# Altium schematic sheet CH32L103G8R6-R0.SchDoc
size 304 x 254 mm
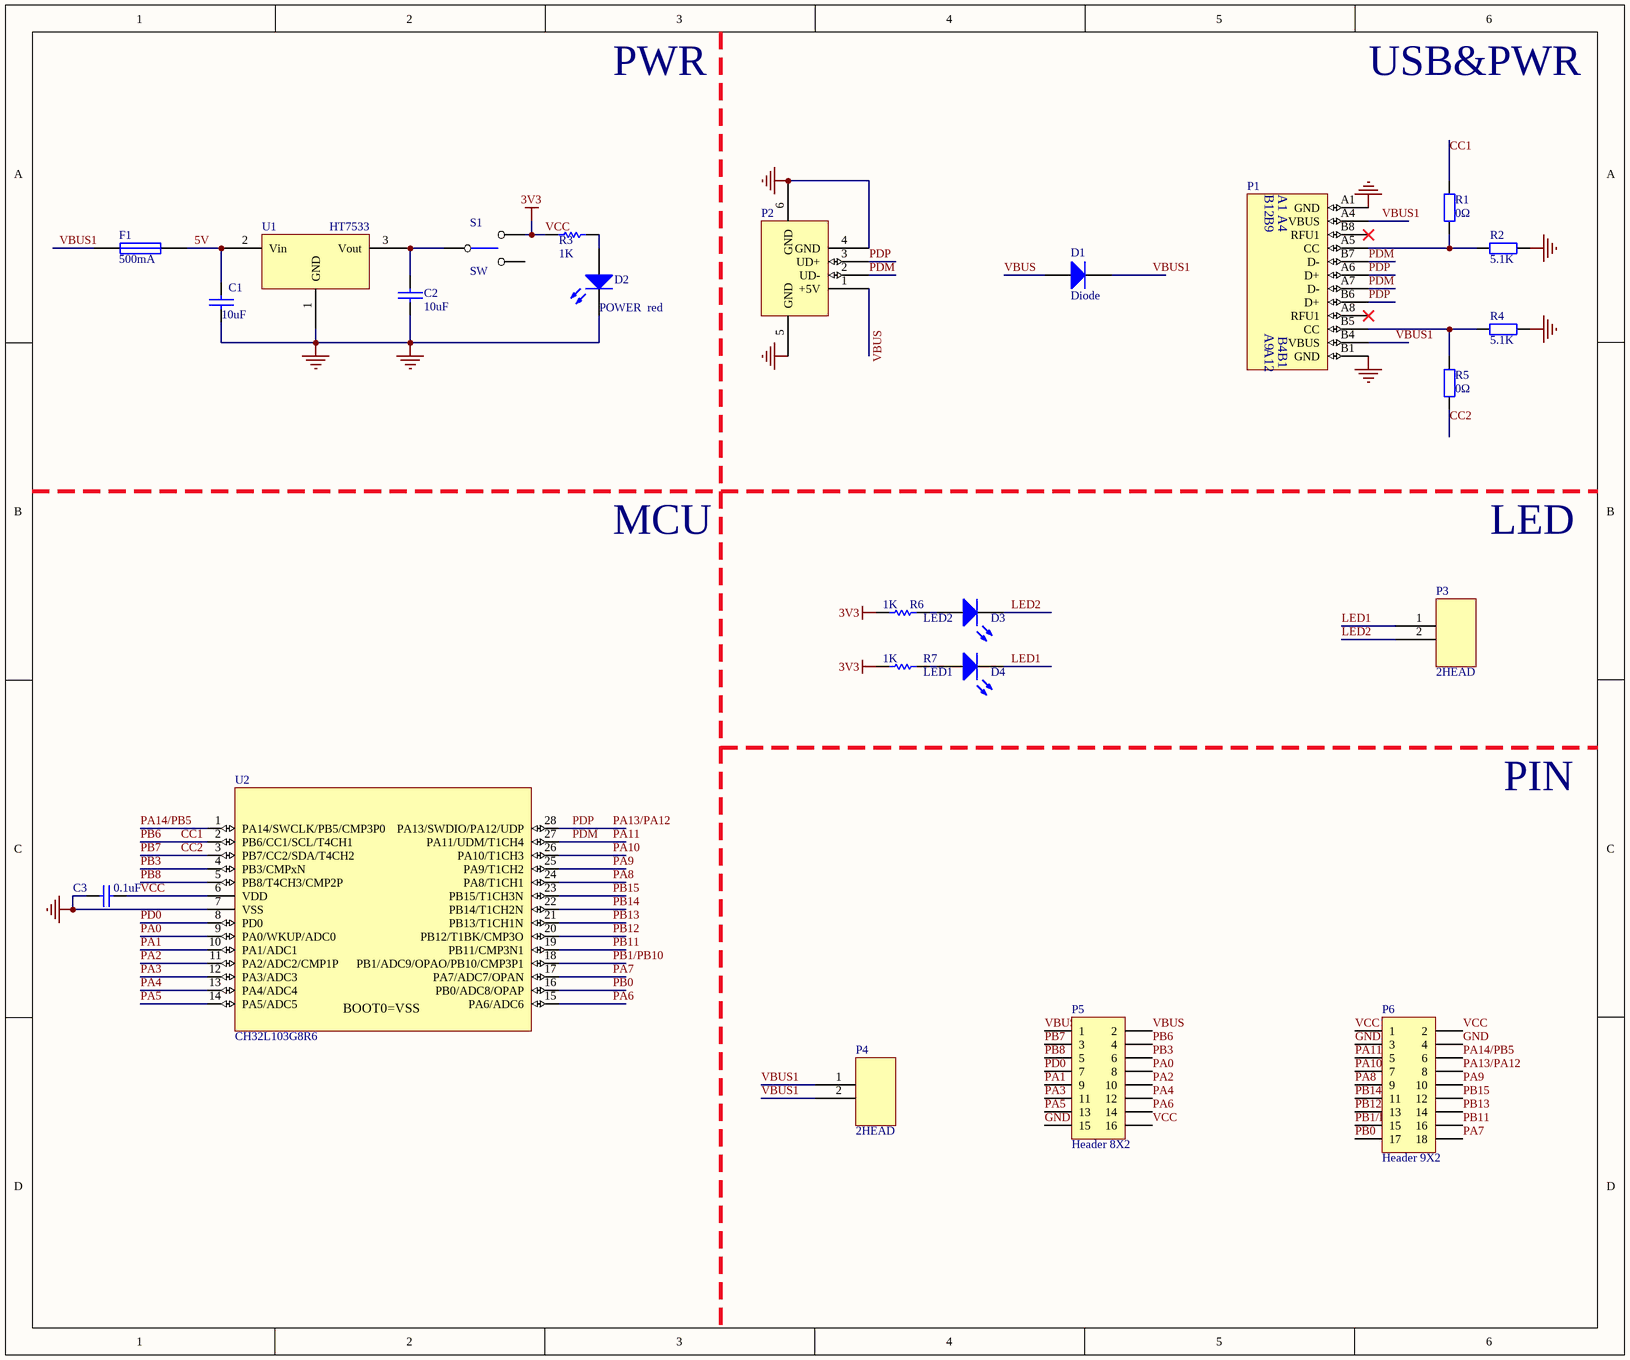
[diagram p0: CH32L103G8R6-R0.SchDoc]

## Parts
C1  10uF  [0603_C]
C2  10uF  [0603_C]
C3  0.1uF  [0603_C]
D1  Diode  [SOD-123]
D2  POWER  red  [0603+]
D3  LED2  [0603+]
D4  LED1  [0603+]
F1  500mA  [0603]
P1  TYPE-C  [TYPE-C-Receptacle-2.0]  (value not drawn)
P2  USB_A  [USBAF]  (value not drawn)
P3  2HEAD  [SIP2-2.54mm]
P4  2HEAD  [SIP2-2.54mm]
P5  Header 8X2  [HDR2X8]
P6  Header 9X2  [HDR2X9]
R1  0Ω  [0603]
R2  5.1K  [0603]
R3  1K  [0603]
R4  5.1K  [0603]
R5  0Ω  [0603]
R6  1K  [0603]
R7  1K  [0603]
S1  SW  [SW1]
U1  HT7533  [SOT-89]
U2  CH32L103G8R6  [QSOP28]

## Nets
GND: C1.2 C2.2 C3.2 D2.2(K) P1.A1(GND) P1.B1(GND) P2.4(GND) P2.5(GND) P2.6(GND) P5.15 P6.3 P6.4 R2.2 R4.2 U1.1(GND) U2.7(VSS)
VCC: C3.1 P5.16 P6.1 P6.2 R3.2 R6.1 R7.1 S1.3 U2.6(VDD)  [also labelled 3V3]
5V: C1.1 F1.2 U1.2(Vin)
CC1: P5.4 R1.2 U2.2(PB6/CC1/SCL/T4CH1)  [also labelled PB6]
CC2: P5.3 R5.1 U2.3(PB7/CC2/SDA/T4CH2)  [also labelled PB7]
LED1: D4.2(K) P3.1
LED2: D3.2(K) P3.2
PA0: P5.8 U2.9(PA0/WKUP/ADC0)
PA1: P5.9 U2.10(PA1/ADC1)
PA2: P5.10 U2.11(PA2/ADC2/CMP1P)
PA3: P5.11 U2.12(PA3/ADC3)
PA4: P5.12 U2.13(PA4/ADC4)
PA5: P5.13 U2.14(PA5/ADC5)
PA6: P5.14 U2.15(PA6/ADC6)
PA7: P6.18 U2.17(PA7/ADC7/OPAN)
PA8: P6.9 U2.24(PA8/T1CH1)
PA9: P6.10 U2.25(PA9/T1CH2)
PA10: P6.7 U2.26(PA10/T1CH3)
PA11: P1.A7(D-) P1.B7(D-) P2.2(UD-) P6.5 U2.27(PA11/UDM/T1CH4)  [also labelled PDM]
PA13/PA12: P1.A6(D+) P1.B6(D+) P2.3(UD+) P6.8 U2.28(PA13/SWDIO/PA12/UDP)  [also labelled PDP]
PA14/PB5: P6.6 U2.1(PA14/SWCLK/PB5/CMP3P0)
PB0: P6.17 U2.16(PB0/ADC8/OPAP)
PB1/PB10: P6.15 U2.18(PB1/ADC9/OPAO/PB10/CMP3P1)
PB3: P5.6 U2.4(PB3/CMPxN)
PB8: P5.5 U2.5(PB8/T4CH3/CMP2P)
PB11: P6.16 U2.19(PB11/CMP3N1)
PB12: P6.13 U2.20(PB12/T1BK/CMP3O)
PB13: P6.14 U2.21(PB13/T1CH1N)
PB14: P6.11 U2.22(PB14/T1CH2N)
PB15: P6.12 U2.23(PB15/T1CH3N)
PD0: P5.7 U2.8(PD0)
VBUS: D1.1(A) P2.1(+5V) P5.1 P5.2
VBUS1: D1.2(K) F1.1 P1.A4(VBUS) P1.B4(VBUS) P4.1 P4.2
NetC2_1: C2.1 S1.1 U1.3(Vout)
NetD2_1: D2.1(A) R3.1
NetD3_1: D3.1(A) R6.2
NetD4_1: D4.1(A) R7.2
NetP1_A5: P1.A5(CC) R1.1 R2.1
NetP1_B5: P1.B5(CC) R4.1 R5.2

Not connected (* = marked no-connect by the designer): P1 A8(RFU1)* B8(RFU1)*; S1 2

## Notes on the sheet
- PWR
- USB&PWR
- MCU
- LED
- PIN
- (in symbol CH32L103G8R6) BOOT0=VSS
- (in symbol TYPE-C1) B12; B9; A9; A12

## Library data of the parts
C1 C2 = CAP: Capacitor
C3 = Cap: Capacitor; Published: 8-Jun-2000; LatestRevisionDate: 17-Jul-2002; LatestRevisionNote: Re-released for DXP Platform.; PackageReference: RAD-0.3; Publisher: Altium Limited
D1 = Diode: Default Diode; Published: 8-Jun-2000; LatestRevisionDate: 17-Jul-2002; LatestRevisionNote: Re-released for DXP Platform.; PackageVersion: Sep-1996; PackageReference: SMC; Publisher: Altium Limited; Code_JEDEC: DO-214-AB
D2-D4 = LED0: Typical INFRARED GaAs LED; Published: 8-Jun-2000; LatestRevisionDate: 08-Jul-2005; LatestRevisionNote: Mech Layer 1 removed.; PackageReference: LED-0; Publisher: Altium Limited
F1 = FUSE1: Fuse
P1 = TYPE-C1
P2 = USB: USB Port
P5 = Header 8X2: Header, 8-Pin, Dual row; LatestRevisionDate: 17-Jul-2002; LatestRevisionNote: Re-released for DXP Platform.; Publisher: Altium Limited
P6 = Header 9X2: Header, 9-Pin, Dual row; LatestRevisionDate: 17-Jul-2002; LatestRevisionNote: Re-released for DXP Platform.; Publisher: Altium Limited
R1 R2 R4 R5 = Res2: Resistor
R3 R6 R7 = Res Semi: Semiconductor Resistor
U1 = 1117-3.3V
U2 = CH32L103G8R6: RISC-V LMD-MCU, 96MHz, USB, Type-C, CAN, OPA, lower power